# Altium schematic sheet Signals1.1.SchDoc
size A2
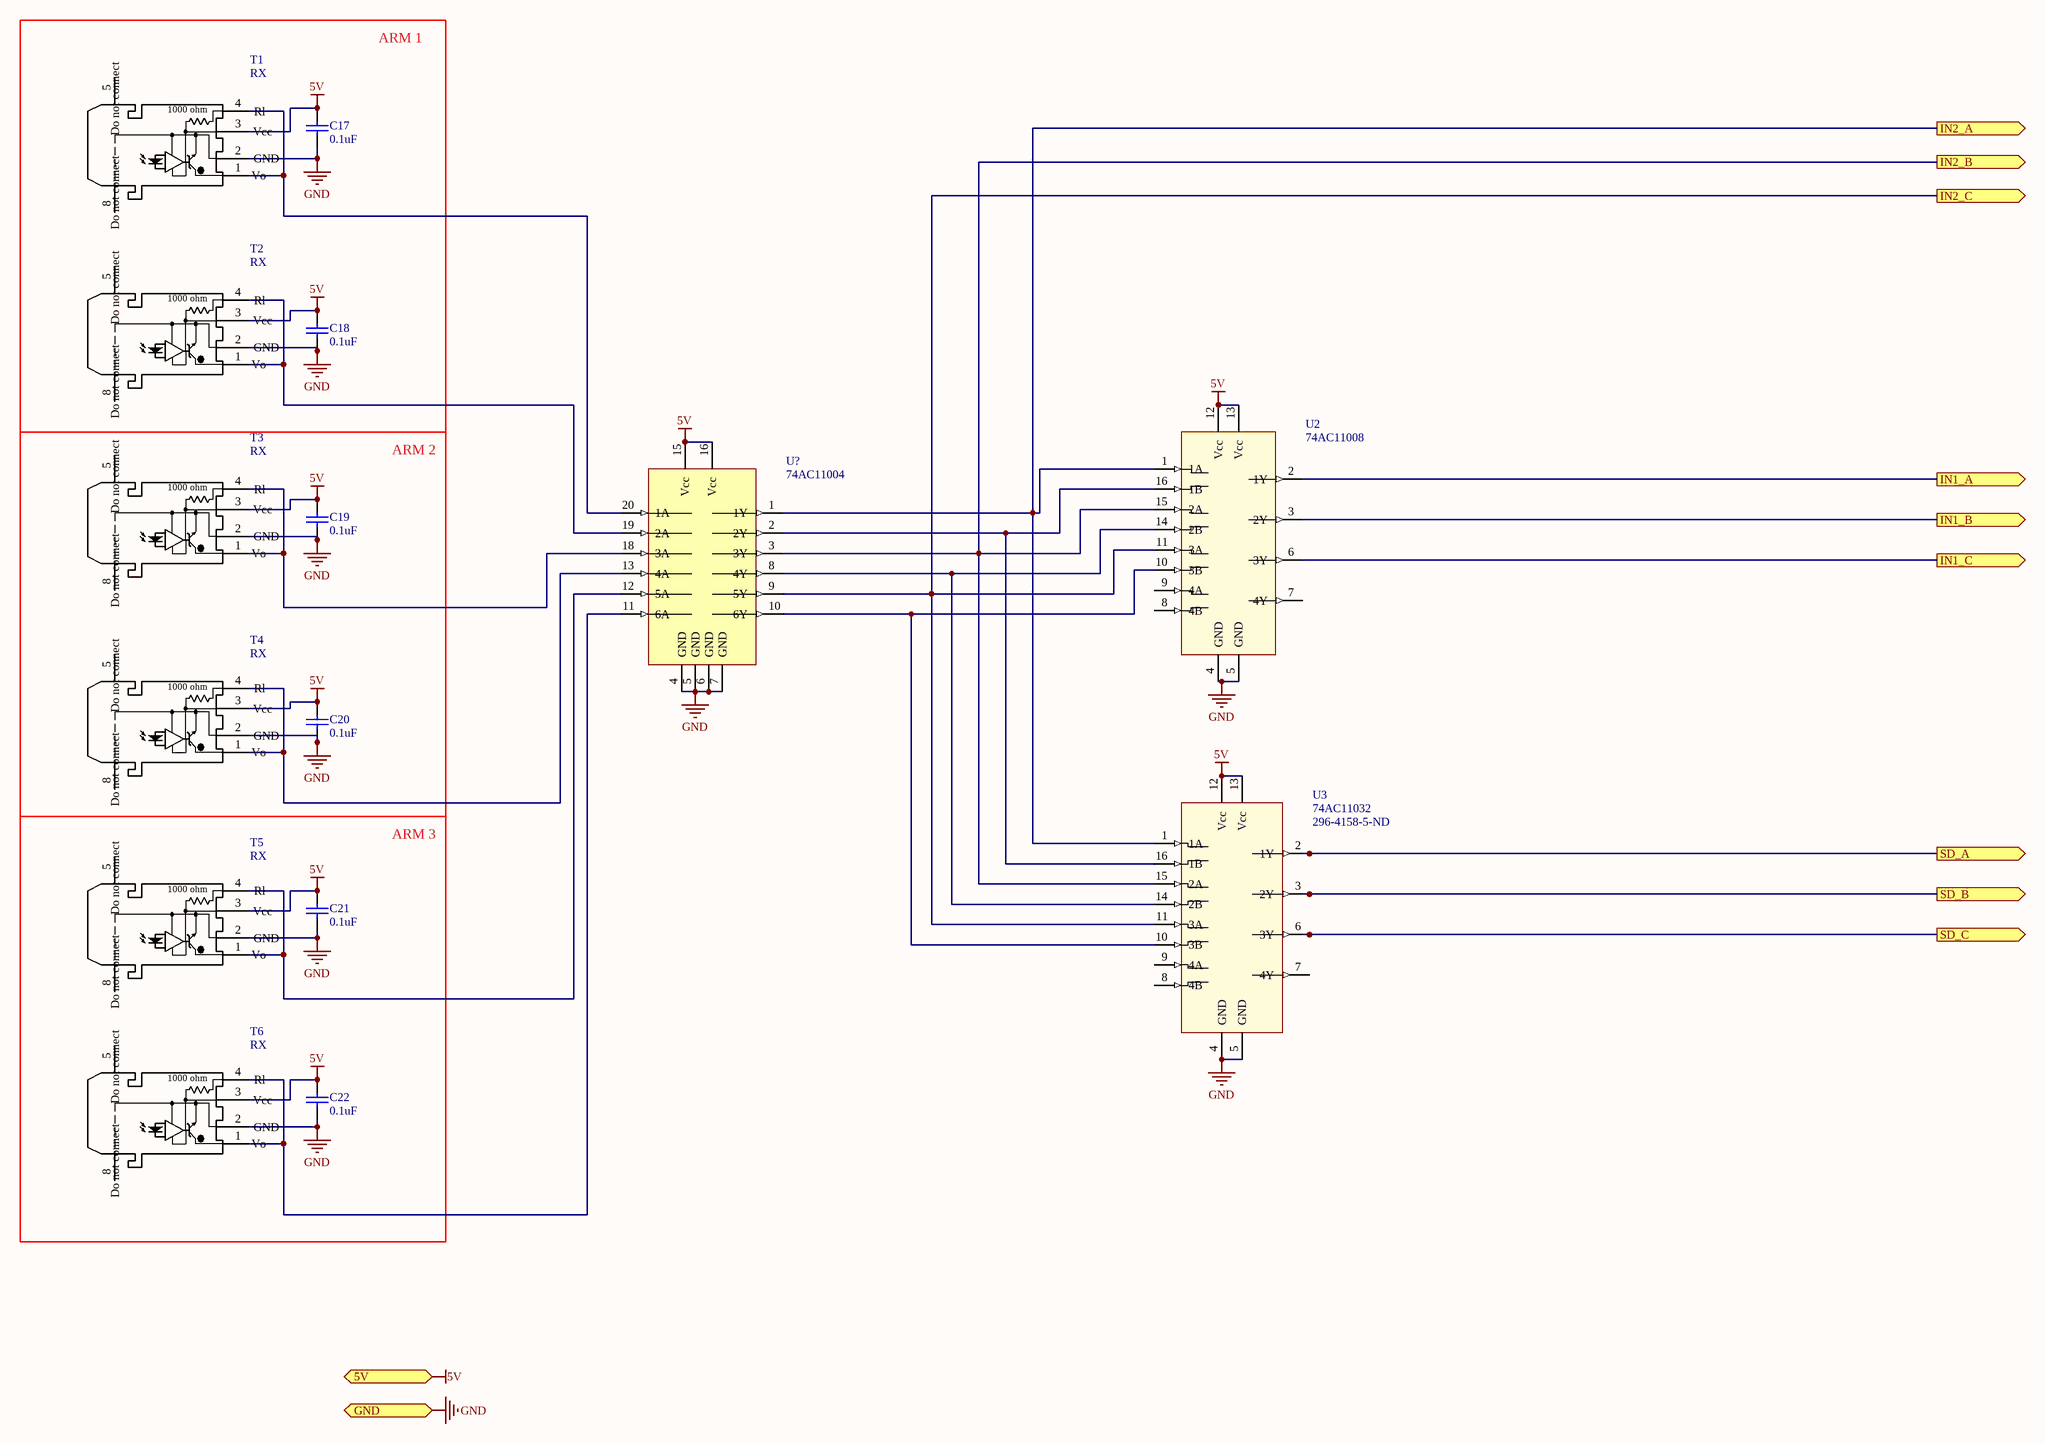
[diagram p0: Signals1.1.SchDoc]

## Parts
C17  value 0.1uF  [RAD-0.3]  (hidden comment: Cap)
C18  value 0.1uF  [RAD-0.3]  (hidden comment: Cap)
C19  value 0.1uF  [RAD-0.3]  (hidden comment: Cap)
C20  value 0.1uF  [RAD-0.3]  (hidden comment: Cap)
C21  value 0.1uF  [RAD-0.3]  (hidden comment: Cap)
C22  value 0.1uF  [RAD-0.3]  (hidden comment: Cap)
T1  RX  [Optics]
T2  RX  [Optics]
T3  RX  [Optics]
T4  RX  [Optics]
T5  RX  [Optics]
T6  RX  [Optics]
U2  74AC11008  [R-PDIP-T16]
U3  74AC11032  Supplier Part Number 1: 296-4158-5-ND  [R-PDIP-T16]
U?  74AC11004  [R-PDIP-T16]

## Blocks framed on the sheet
ARM 1: C17 C18 T1 T2
ARM 2: C19 C20 T3 T4
ARM 3: C21 C22 T5 T6

## Ports
5V, GND, IN1_A (out), IN1_B (out), IN1_C (out), IN2_A (out), IN2_B (out), IN2_C (out), SD_A (out), SD_B (out), SD_C (out)

## Nets
5V: C17.2 C18.2 C19.2 C20.2 C21.2 C22.2 T1.3(Vcc) T2.3(Vcc) T3.3(Vcc) T4.3(Vcc) T5.3(Vcc) T6.3(Vcc) U2.12(Vcc) U2.13(Vcc) U3.12(Vcc) U3.13(Vcc) U?.15(Vcc) U?.16(Vcc) ; port 5V
GND: C17.1 C18.1 C19.1 C20.1 C21.1 C22.1 T1.2(GND) T2.2(GND) T3.2(GND) T4.2(GND) T5.2(GND) T6.2(GND) U2.4(GND) U2.5(GND) U3.4(GND) U3.5(GND) U?.4(GND) U?.5(GND) U?.6(GND) U?.7(GND) ; port GND
IN1_A: U2.2(1Y) ; port IN1_A
IN1_B: U2.3(2Y) ; port IN1_B
IN1_C: U2.6(3Y) ; port IN1_C
IN2_A: U2.1(1A) U3.1(1A) U?.1(1Y) ; port IN2_A
IN2_B: U2.15(2A) U3.15(2A) U?.3(3Y) ; port IN2_B
IN2_C: U2.11(3A) U3.11(3A) U?.9(5Y) ; port IN2_C
SD_A: U3.2(1Y) ; port SD_A
SD_B: U3.3(2Y) ; port SD_B
SD_C: U3.6(3Y) ; port SD_C
NetT1_1: T1.1(Vo) T1.4(Rl) U?.20(1A)
NetT2_1: T2.1(Vo) T2.4(Rl) U?.19(2A)
NetT3_1: T3.1(Vo) T3.4(Rl) U?.18(3A)
NetT4_1: T4.1(Vo) T4.4(Rl) U?.13(4A)
NetT5_1: T5.1(Vo) T5.4(Rl) U?.12(5A)
NetT6_1: T6.1(Vo) T6.4(Rl) U?.11(6A)
NetU2_10: U2.10(3B) U3.10(3B) U?.10(6Y)
NetU2_14: U2.14(2B) U3.14(2B) U?.8(4Y)
NetU2_16: U2.16(1B) U3.16(1B) U?.2(2Y)

Not connected (* = marked no-connect by the designer): T1 5(Do_not_connect) 8(Do_not_connect); T2 5(Do_not_connect) 8(Do_not_connect); T3 5(Do_not_connect) 8(Do_not_connect); T4 5(Do_not_connect) 8(Do_not_connect); T5 5(Do_not_connect) 8(Do_not_connect); T6 5(Do_not_connect) 8(Do_not_connect); U2 7(4Y) 8(4B) 9(4A); U3 7(4Y) 8(4B) 9(4A)

## Notes on the sheet
- (in symbol HFBR-2524Z) 1000 ohm

## Library data of the parts
C17-C22 = Cap: Capacitor; Published: 8-Jun-2000; LatestRevisionDate: 17-Jul-2002; LatestRevisionNote: Re-released for DXP Platform.; PackageReference: RAD-0.3; Publisher: Altium Limited; PackageDescription: Radial Cap, Thru-Hole; 2 Leads; 0.3 in Pin Spacing
T1-T6 = HFBR-2524Z: Optical Reciever; Manufacturer: Broadcom Avago; Wavelength: 660nm; Data Rate: 115Kbps; Operating Supply Current: 10mA; Supply Voltage: 5V; Max Output Current: 25mA; Max Supply Voltage: 7V; Min Supply Voltage: -500mV; Supplier 1: Digikey; Supplier Part Number 1: 516-2065-ND; Manufacturer Part Number: HFBR-2524Z; Stock 1: 898; Pricing 1: 1=11.66, 10=10.56, 25=8.36, 100=7.04, 250=6.6, 500=6.05, 1000=5.72 (USD); Mount: Through Hole; Case/Package: Module; Number of Pins: 6; Min Operating Temperature: -40°C; Max Operating Temperature: 85°C; Packaging: Rail/Tube; Package Quantity: 200; Output Current: 25mA; Length: 18.8mm; Height: 7.62mm; Width: 10.16mm; Radiation Hardening: No; REACH SVHC: No SVHC; Lead Free: Lead Free; ComponentLink1URL: https://datasheet.ciiva.com/27747/2062168-27747937.pdf; ComponentLink1Description: https://datasheet.ciiva.com/27747/2062168-27747937.pdf; ComponentLink2URL: https://datasheet.ciiva.com/26347/58-0778-26347366.pdf; ComponentLink2Description: https://datasheet.ciiva.com/26347/58-0778-26347366.pdf; ComponentLink3URL: https://datasheet.ciiva.com/15132/getdatasheetpartid-95226-15132984.pdf; ComponentLink3Description: https://datasheet.ciiva.com/15132/getdatasheetpartid-95226-15132984.pdf; ComponentLink4URL: https://datasheet.ciiva.com/18408/70158103-18408588.pdf; ComponentLink4Description: https://datasheet.ciiva.com/18408/70158103-18408588.pdf; ComponentLink5URL: https://datasheet.ciiva.com/26913/hfbr-2524z-26913569.pdf; ComponentLink5Description: https://datasheet.ciiva.com/26913/hfbr-2524z-26913569.pdf
U2 = 74AC11008: AND GATE; Manufacturer: Texas Instruments; Manufacturer Part Number: 74AC11008N; Number of Inputs: 2; Propagation Delay: 6.9ns; Min Supply Voltage: 3V; Max Supply Voltage: 5.5V; Number of Outputs: 1; Supply Voltage: 5V; Output Current: 24mA; Number of Circuits: 4; Quiescent Current: 4uA; High Level Output Current: -24mA; Schmitt Trigger Input: No; Supplier 1: Digikey; Stock 1: 236; Pricing 1: 1=2.36, 10=2.12, 100=1.704, 500=1.4, 1000=1.16 (USD); Mount: Through Hole; Case/Package: DIP; Number of Pins: 16; Weight: 0.03357oz; Contact Plating: Gold; Min Operating Temperature: -40°C; Max Operating Temperature: 85°C; Package Quantity: 25; Packaging: Rail/Tube; Logic Function: AND; Low Level Output Current: 24mA; Number of Gates: 4; Number of Elements: 4; Number of Input Lines: 2; Number of Output Lines: 1; Turn-On Delay Time: 6.9ns; Number of Bits: 4; Length: 19.69mm; Height: 4.57mm; Width: 6.6mm; Radiation Hardening: No; Lead Free: Lead Free; REACH SVHC: No SVHC; ComponentLink1URL: https://datasheet.ciiva.com/1869/74ac11008-1869907.pdf; ComponentLink1Description: https://datasheet.ciiva.com/1869/74ac11008-1869907.pdf; ComponentLink2URL: https://datasheet.ciiva.com/15215/getdatasheetpartid-541532-15215429.pdf; ComponentLink2Description: https://datasheet.ciiva.com/15215/getdatasheetpartid-541532-15215429.pdf; Supplier Part Number 1: 296-4154-5-ND
U3 = 74AC11032: OR GATE; Manufacturer: Texas Instruments; Manufacturer Part Number: 74AC11032N; Min Supply Voltage: 3V; Max Supply Voltage: 5.5V; Propagation Delay: 6.7ns; Supply Voltage: 5V; Number of Outputs: 1; Number of Inputs: 2; Number of Circuits: 4; Quiescent Current: 4uA; High Level Output Current: -24mA; Low Level Output Current: 24mA; Schmitt Trigger Input: No; Supplier 1: Digikey; Stock 1: 1085; Pricing 1: 1=2.36, 10=2.12, 100=1.704, 500=1.4, 1000=1.16 (USD); Mount: Through Hole; Case/Package: PDIP; Number of Pins: 16; Weight: 0.03357oz; Contact Plating: Gold; Min Operating Temperature: -40°C; Max Operating Temperature: 85°C; Package Quantity: 25; Packaging: Rail/Tube; Logic Function: OR; Number of Gates: 4; Number of Elements: 4; Output Current: 24mA; Number of Input Lines: 2; Number of Output Lines: 1; Turn-On Delay Time: 6.7ns; Number of Bits: 4; Length: 19.69mm; Height: 4.57mm; Width: 6.6mm; Radiation Hardening: No; Lead Free: Lead Free; REACH SVHC: No SVHC; ComponentLink1URL: https://datasheet.ciiva.com/1153/74ac11032-1153745.pdf; ComponentLink1Description: https://datasheet.ciiva.com/1153/74ac11032-1153745.pdf; ComponentLink2URL: https://datasheet.ciiva.com/1869/74ac11032-1869912.pdf; ComponentLink2Description: https://datasheet.ciiva.com/1869/74ac11032-1869912.pdf
U? = 74AC11004: Hex Inverter; Manufacturer: Texas Instruments; Manufacturer Part Number: 74AC11004N; Logic Function: Buffer,Inverter; Number of Elements: 6; Supply Voltage: 5V; Propagation Delay: 10ns; Max Supply Voltage: 5.5V; Min Supply Voltage: 3V; Number of Inputs: 1; Output Current: 24mA; Quiescent Current: 4uA; High Level Output Current: -24mA; Schmitt Trigger Input: No; Supplier 1: Digikey; Stock 1: 747; Pricing 1: 1=2.36, 10=2.12, 100=1.704, 500=1.4, 1000=1.16 (USD); Mount: Through Hole; Case/Package: PDIP; Number of Pins: 20; Weight: 0.042297oz; Contact Plating: Gold; Min Operating Temperature: -40°C; Max Operating Temperature: 85°C; Packaging: Rail/Tube; Package Quantity: 20; Number of Circuits: 6; Low Level Output Current: 24mA; Turn-On Delay Time: 10ns; Number of Gates: 6; Number of Bits: 6; Length: 26.92mm; Height: 4.57mm; Width: 6.6mm; Radiation Hardening: No; Lead Free: Lead Free; REACH SVHC: No SVHC; ComponentLink1URL: https://datasheet.ciiva.com/14289/74ac11004-14289990.pdf; ComponentLink1Description: https://datasheet.ciiva.com/14289/74ac11004-14289990.pdf; ComponentLink2URL: https://datasheet.ciiva.com/1869/74ac11004-1869911.pdf; ComponentLink2Description: https://datasheet.ciiva.com/1869/74ac11004-1869911.pdf; ComponentLink3URL: https://datasheet.ciiva.com/1157/1763878-1157128.pdf; ComponentLink3Description: https://datasheet.ciiva.com/1157/1763878-1157128.pdf; ComponentLink4URL: https://datasheet.ciiva.com/15089/getdatasheetpartid-371764-15089641.pdf; ComponentLink4Description: https://datasheet.ciiva.com/15089/getdatasheetpartid-371764-15089641.pdf; ComponentLink5URL: https://datasheet.ciiva.com/1153/1817335-1153741.pdf; ComponentLink5Description: https://datasheet.ciiva.com/1153/1817335-1153741.pdf; ComponentLink6URL: https://datasheet.ciiva.com/41426/001015348-da-01-en-ic-hex-inverter-7-74ac11004n-pdip-20-tid-41426322.pdf; ComponentLink6Description: https://datasheet.ciiva.com/41426/001015348-da-01-en-ic-hex-inverter-7-74ac11004n-pdip-20-tid-41426322.pdf; Supplier Part Number 1: 296-4153-5-ND